# Altium project 恒温烤箱控制系统.PrjPCB
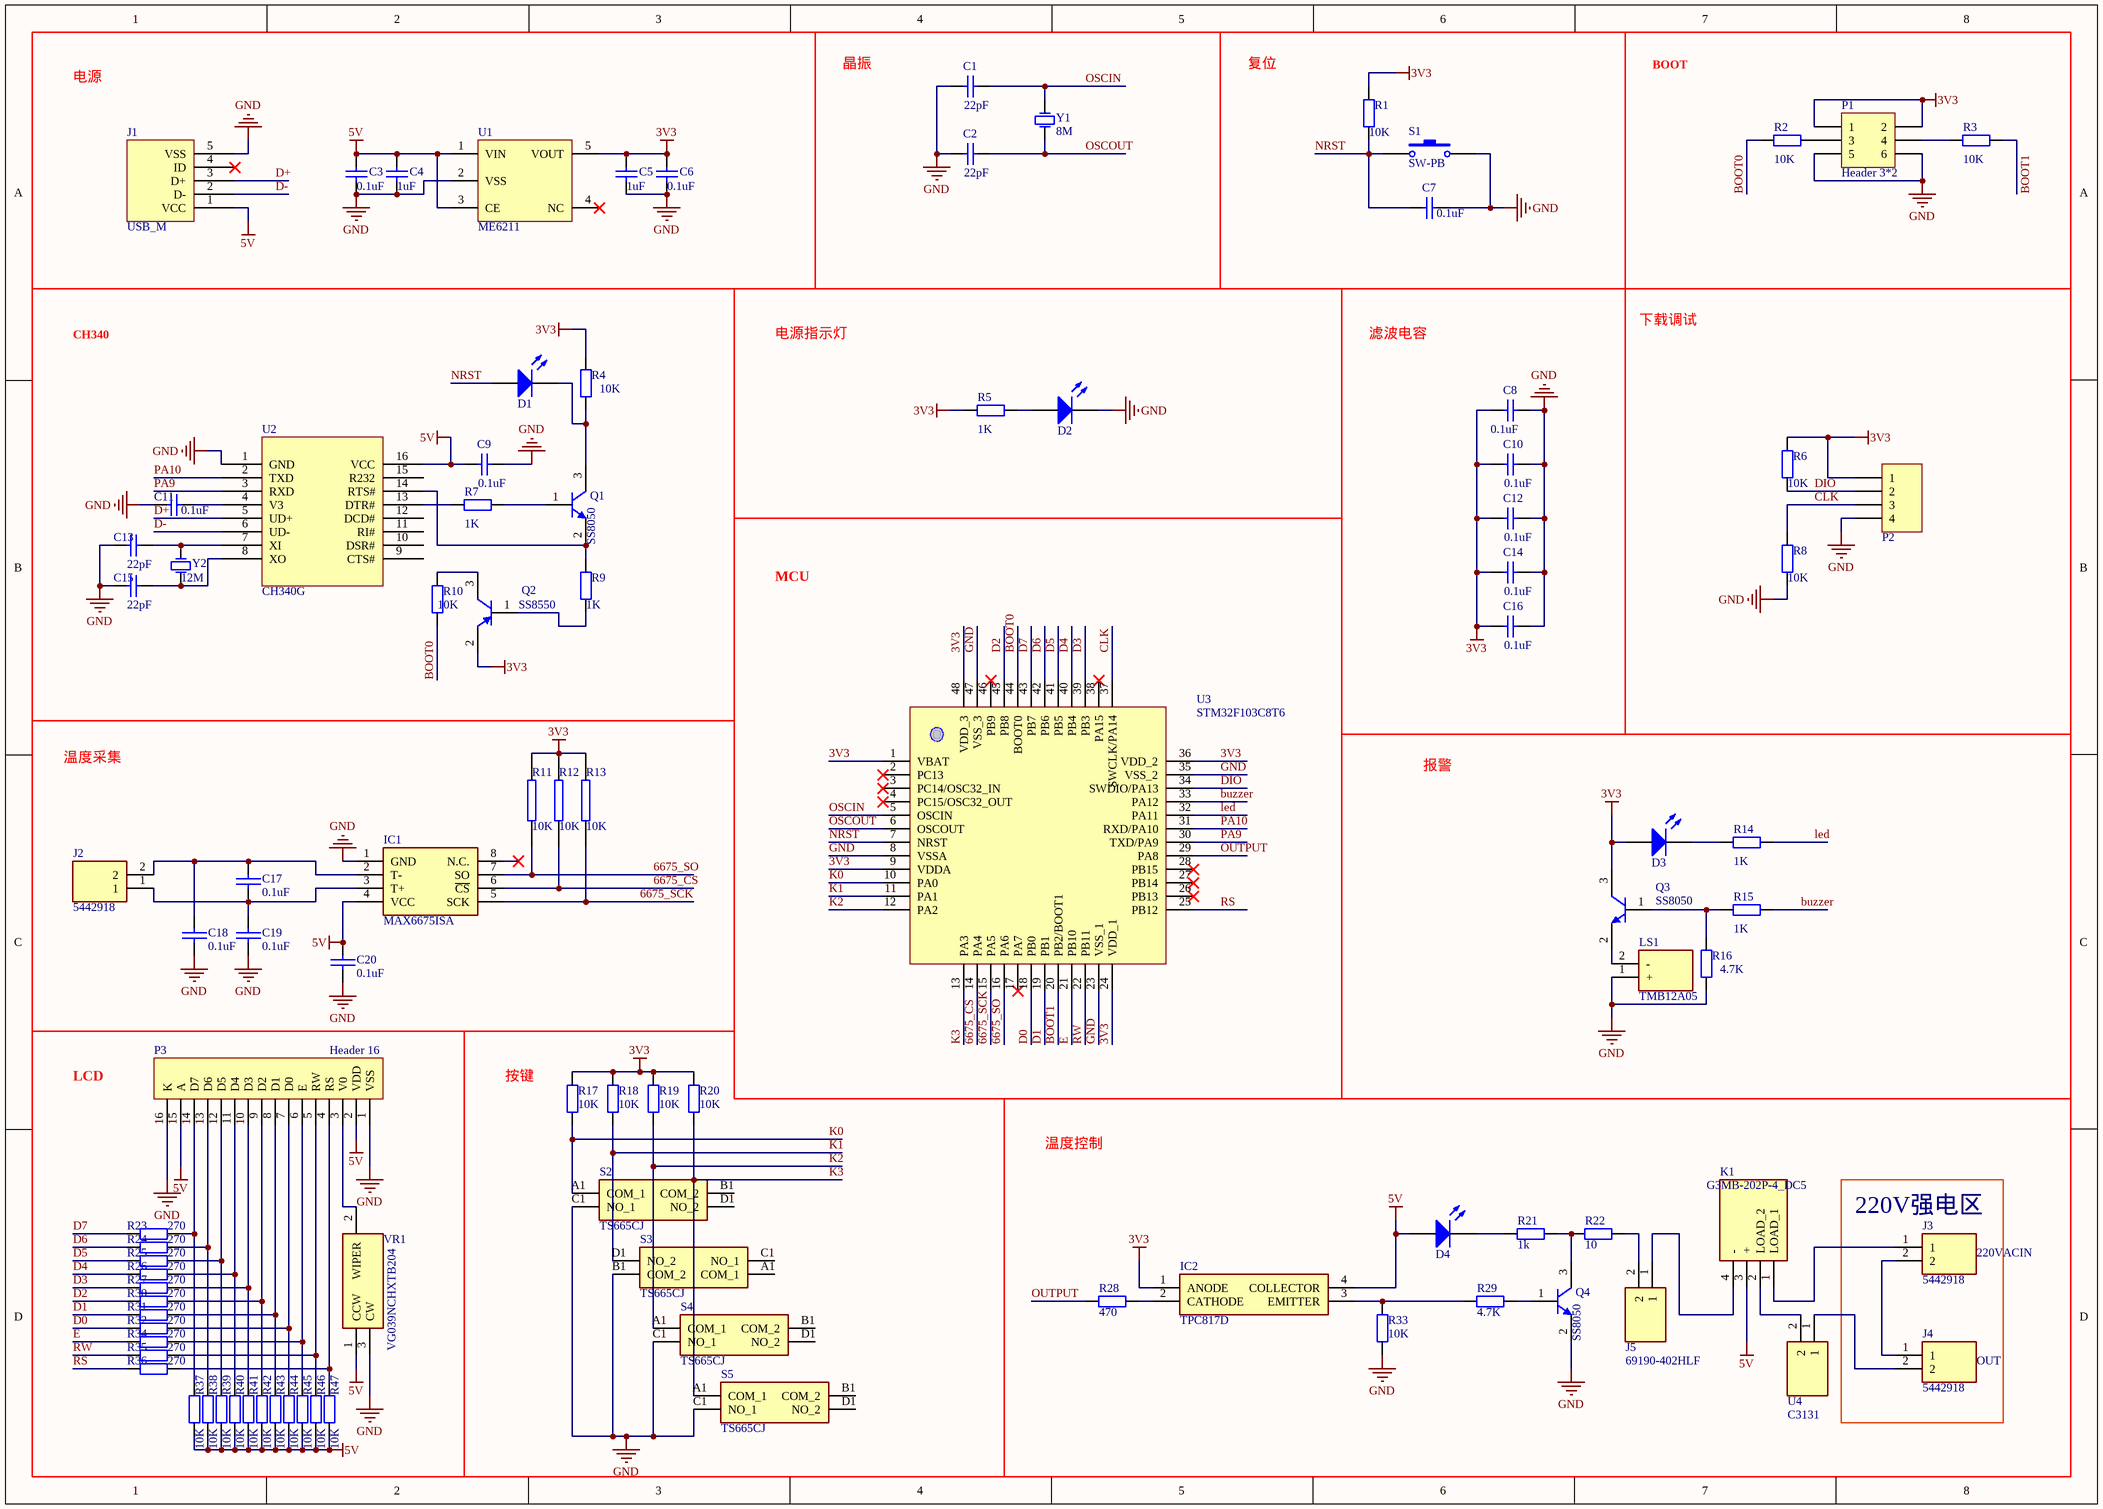
[diagram p0: sheet.SchDoc]
1 sheet, 99 parts. Net scope: global (net labels, ports and power ports of the same name join across sheets).
Board file: PCB.PcbDoc

## Sheet sheet.SchDoc
size A3

### Parts
C1  22pF  [0603_C]
C2  22pF  [0603_C]
C3  0.1uF  [0603_C]
C4  1uF  [0603_C]
C5  1uF  [0603_C]
C6  0.1uF  [0603_C]
C7  0.1uF  [0603_C]
C8  0.1uF  [0603_C]
C9  0.1uF  [0603_C]
C10  0.1uF  [0603_C]
C11  0.1uF  [0603_C]
C12  0.1uF  [0603_C]
C13  22pF  [0603_C]
C14  0.1uF  [0603_C]
C15  22pF  [0603_C]
C16  0.1uF  [0603_C]
C17  0.1uF  [1206]
C18  0.1uF  [1206]
C19  0.1uF  [1206]
C20  0.1uF  [1206]
D1  LED0  [LED_0805_Blue]  (value not drawn)
D2  LED0  [LED_0805_Blue]  (value not drawn)
D3  LED0  [LED_0805_Blue]  (value not drawn)
D4  LED0  [LED_0805_Blue]  (value not drawn)
IC1  MAX6675ISA  [SOIC127P600X175-8N]
IC2  TPC817D  [DIP810W50P254L460H368Q4N]
J1  USB_M  [USB]
J2  5442918  [SHDR2W100P0X508_1X2_1016X1120X1820P]
J3  5442918  [SHDR2W100P0X508_1X2_1016X1120X1820P]
J4  5442918  [SHDR2W100P0X508_1X2_1016X1120X1820P]
J5  69190-402HLF  [HDRV2W90P0X254_1X2_508X241X858P]
K1  G3MB-202P-4_DC5  [G3MB202P4DC5]
LS1  TMB12A05  [TMB12A05]
P1  Header 3*2  [HDR3X2]
P2  Header 4  [HDR4X1_A]  (value not drawn)
P3  Header 16  [HDR16X1_A]
Q1  SS8050  [SOT-23]
Q2  SS8550  [SOT-23]
Q3  SS8050  [SOT-23]
Q4  SS8050  [SOT-23]
R1  10K  [0603_R]
R2  10K  [0603_R]
R3  10K  [0603_R]
R4  10K  [0603_R]
R5  1K  [0603_R]
R6  10K  [0603_R]
R7  1K  [0603_R]
R8  10K  [0603_R]
R9  1K  [0603_R]
R10  10K  [0603_R]
R11  10K  [1206]
R12  10K  [1206]
R13  10K  [1206]
R14  1K  [0603_R]
R15  1K  [0603_R]
R16  4.7K  [0603_R]
R17  10K  [1206]
R18  10K  [1206]
R19  10K  [1206]
R20  10K  [1206]
R21  1k  [1206]
R22  10  [1206]
R23  270  [0603_R]
R24  270  [0603_R]
R25  270  [0603_R]
R26  270  [0603_R]
R27  270  [0603_R]
R28  470  [1206]
R29  4.7K  [1206]
R30  270  [0603_R]
R31  270  [0603_R]
R32  270  [0603_R]
R33  10K  [1206]
R34  270  [0603_R]
R35  270  [0603_R]
R36  270  [0603_R]
R37  10K  [0603_R]
R38  10K  [0603_R]
R39  10K  [0603_R]
R40  10K  [0603_R]
R41  10K  [0603_R]
R42  10K  [0603_R]
R43  10K  [0603_R]
R44  10K  [0603_R]
R45  10K  [0603_R]
R46  10K  [0603_R]
R47  10K  [0603_R]
S1  SW-PB  [SW_PB2_A1]
S2  TS665CJ  [TS665CJ]
S3  TS665CJ  [TS665CJ]
S4  TS665CJ  [TS665CJ]
S5  TS665CJ  [TS665CJ]
U1  ME6211  [SOT23-5]
U2  CH340G  [SOP-16]
U3  STM32F103C8T6  [LQFP-48_M]
U4  C3131  [C3131]
VR1  VG039NCHXTB204  [VG039NCHXTB204]
Y1  8M  [5032]
Y2  12M  [5032]

### Blocks framed on the sheet
220V强电区: J3 J4

### Nets
3V3: C5.2 C6.2 C8.2 C10.2 C12.2 C14.2 C16.2 D3.1(A) IC2.1(ANODE) P1.1 P1.2 P2.1 Q2.2(E) Q3.3(C) R1.2 R4.2 R5.1 R6.2 R11.2 R12.2 R13.2 R17.2 R18.2 R19.2 R20.2 U1.5(VOUT) U3.1(VBAT) U3.9(VDDA) U3.24(VDD_1) U3.36(VDD_2) U3.48(VDD_3)
5V: C3.2 C4.2 C9.1 C20.1 D4.1(A) IC1.4(VCC) IC2.4(COLLECTOR) J1.1(VCC) K1.3(+) P3.2(VDD) P3.15(A) R37.1 R38.1 R39.1 R40.1 R41.1 R42.1 R43.1 R44.1 R45.1 R46.1 R47.1 U1.1(VIN) U1.3(CE) U2.16(VCC) VR1.1(CCW)
GND: C1.2 C2.2 C3.1 C4.1 C5.1 C6.1 C7.2 C8.1 C9.2 C10.1 C11.1 C12.1 C13.2 C14.1 C15.2 C16.1 C18.2 C19.2 C20.2 D2.2(K) IC1.1(GND) J1.5(VSS) LS1.1(+) P1.5 P1.6 P2.4 P3.1(VSS) P3.16(K) Q4.2(E) R8.1 R16.1 R33.1 S1.2 S2.C1(NO_1) S3.B1(COM_2) S4.C1(NO_1) S5.C1(NO_1) U1.2(VSS) U2.1(GND) U3.8(VSSA) U3.23(VSS_1) U3.35(VSS_2) U3.47(VSS_3) VR1.3(CW)
6675_CS: IC1.6(~{CS}) R12.1 U3.14(PA4)
6675_SCK: IC1.5(SCK) R13.1 U3.15(PA5)
6675_SO: IC1.7(SO) R11.1 U3.16(PA6)
BOOT0: R2.1 R10.1 U3.44(BOOT0)
BOOT1: R3.2 U3.20(PB2/BOOT1)
buzzer: R15.2 U3.33(PA12)
CLK: P2.3 R8.2 U3.37(SWCLK/PA14)
D0: R32.2 U3.18(PB0)
D1: R31.2 U3.19(PB1)
D2: R30.2 U3.45(PB8)
D3: R27.2 U3.39(PB3)
D4: R26.2 U3.40(PB4)
D5: R25.2 U3.41(PB5)
D6: R24.2 U3.42(PB6)
D7: R23.2 U3.43(PB7)
D+: J1.3(D+) U2.5(UD+)
D-: J1.2(D-) U2.6(UD-)
DIO: P2.2 R6.1 U3.34(SWDIO/PA13)
E: R34.2 U3.21(PB10)
K0: R17.1 S2.A1(COM_1) U3.10(PA0)
K1: R18.1 S3.D1(NO_2) U3.11(PA1)
K2: R19.1 S4.A1(COM_1) U3.12(PA2)
K3: R20.1 S5.A1(COM_1) U3.13(PA3)
led: R14.2 U3.32(PA11)
NRST: C7.1 D1.1(A) R1.1 S1.1 U3.7(NRST)
OSCIN: C1.1 U3.5(OSCIN) Y1.1(OSC1)
OSCOUT: C2.1 U3.6(OSCOUT) Y1.2(OSC2)
OUTPUT: R28.2 U3.29(PA8)
PA9: U2.3(RXD) U3.30(TXD/PA9)
PA10: U2.2(TXD) U3.31(RXD/PA10)
RS: R36.2 U3.25(PB12)
RW: R35.2 U3.22(PB11)
NetC11_2: C11.2 U2.4(V3)
NetC13_1: C13.1 U2.7(XI) Y2.1(OSC1)
NetC15_1: C15.1 U2.8(XO) Y2.2(OSC2)
NetC17_1: C17.1 C18.1 IC1.2(T-) J2.2
NetC17_2: C17.2 C19.1 IC1.3(T+) J2.1
NetD1_2: D1.2(K) Q1.3(C) R4.1
NetD2_1: D2.1(A) R5.2
NetD3_2: D3.2(K) R14.1
NetD4_2: D4.2(K) R21.2
NetIC2_2: IC2.2(CATHODE) R28.1
NetIC2_3: IC2.3(EMITTER) R29.2 R33.2
NetJ3_1: J3.1 K1.1(LOAD_1)
NetJ3_2: J3.2 J4.1
NetJ4_2: J4.2 U4.1
NetJ5_1: J5.1 K1.4(-)
NetJ5_2: J5.2 R22.1
NetK1_2: K1.2(LOAD_2) U4.2
NetLS1_2: LS1.2(-) Q3.2(E)
NetP1_3: P1.3 R2.2
NetP1_4: P1.4 R3.1
NetP3_3: P3.3(V0) VR1.2(WIPER)
NetP3_4: P3.4(RS) R36.1 R47.2
NetP3_5: P3.5(RW) R35.1 R46.2
NetP3_6: P3.6(E) R34.1 R45.2
NetP3_7: P3.7(D0) R32.1 R44.2
NetP3_8: P3.8(D1) R31.1 R43.2
NetP3_9: P3.9(D2) R30.1 R42.2
NetP3_10: P3.10(D3) R27.1 R41.2
NetP3_11: P3.11(D4) R26.1 R40.2
NetP3_12: P3.12(D5) R25.1 R39.2
NetP3_13: P3.13(D6) R24.1 R38.2
NetP3_14: P3.14(D7) R23.1 R37.2
NetQ1_1: Q1.1(B) R7.2
NetQ1_2: Q1.2(E) R9.2 U2.14(RTS#)
NetQ2_1: Q2.1(B) R9.1
NetQ2_3: Q2.3(C) R10.2
NetQ3_1: Q3.1(B) R15.1 R16.2
NetQ4_1: Q4.1(B) R29.1
NetQ4_3: Q4.3(C) R21.1 R22.2
NetR7_1: R7.1 U2.13(DTR#)

Not connected (* = marked no-connect by the designer): IC1 8(N.C.)*; J1 4(ID)*; S2 B1(COM_2) D1(NO_2); S3 A1(COM_1) C1(NO_1); S4 B1(COM_2) D1(NO_2); S5 B1(COM_2) D1(NO_2); U1 4(NC)*; U2 9(CTS#) 10(DSR#) 11(RI#) 12(DCD#) 15(R232); U3 2(PC13)* 3(PC14/OSC32_IN)* 4(PC15/OSC32_OUT)* 17(PA7)* 26(PB13)* 27(PB14)* 28(PB15)* 38(PA15)* 46(PB9)*

### Notes on the sheet
- 电源
- 晶振
- 复位
- BOOT
- CH340
- 电源指示灯
- 滤波电容
- 下载调试
- MCU
- 温度采集
- 报警
- LCD
- (near R17) 按键
- 温度控制
- 220VACIN
- OUT

### Library data of the parts
C1-C16 = Cap: 无极性电容; Published: 8-Jun-2000; LatestRevisionDate: 17-Jul-2002; LatestRevisionNote: Re-released for DXP Platform.; PackageReference: RAD-0.3; Publisher: Altium Limited
  C1 C2 C13 C15: Value: 22pF
  C3 C6-C12 C14 C16: Value: 0.1uF
  C4 C5: Value: 1uF
C17-C20 = 普通电容: Capacitor
D1-D4 = LED0: 发光二极管; Published: 8-Jun-2000; LatestRevisionDate: 08-Jul-2005; LatestRevisionNote: Mech Layer 1 removed.; PackageReference: LED-0; Publisher: Altium Limited
IC1 = MAX6675ISA: Integrated Circuit; Manufacturer_Name: Maxim Integrated; Datasheet Link: http://datasheets.maximintegrated.com/en/ds/MAX6675.pdf; Height: 1.75mm; Manufacturer_Part_Number: MAX6675ISA; Mouser Part Number: N/A; Mouser Price/Stock: https://www.mouser.com/Search/Refine.aspx?Keyword=N%2FA
IC2 = TPC817D: Integrated Circuit; Manufacturer_Name: Taiwan Semiconductor; Datasheet Link: http://www.taiwansemi.com/products/datasheet/TPC817%20SERIES_C1612.pdf; Height: 3.68mm; Manufacturer_Part_Number: TPC817D; Mouser Part Number: 821-TPC817D; Mouser Price/Stock: https://www.mouser.com/Search/Refine.aspx?Keyword=821-TPC817D
J1 = USB_M: MicroUSB接口
J2-J4 = 5442918: Connector; Manufacturer_Name: Phoenix Contact; Allied_Number: 71272099; Datasheet Link: https://www.phoenixcontact.com/online/portal/gb/?uri=pxc-oc-itemdetail:pid=5442918&library=gben&pcck=P&tab=1&selectedCategory=ALL; Height: 18.2mm; Manufacturer_Part_Number: 5442918; Mouser Part Number: 651-5442918; Mouser Price/Stock: https://www.mouser.com/Search/Refine.aspx?Keyword=651-5442918; Allied Price/Stock: https://www.alliedelec.com/phoenixcontact-5442918/71272099/
J5 = 69190-402HLF: Connector; Manufacturer_Name: Amphenol; Allied_Number: 70302517; Datasheet Link: https://cdn.amphenol-icc.com/media/wysiwyg/files/drawing/69190.pdf; Height: 8.58mm; Manufacturer_Part_Number: 69190-402HLF; Mouser Part Number: 649-69190-402HLF; Mouser Price/Stock: https://www.mouser.com/Search/Refine.aspx?Keyword=649-69190-402HLF; RS Part Number: 8632731; RS Price/Stock: http://uk.rs-online.com/web/p/products/8632731; Allied Price/Stock: https://www.alliedelec.com/amphenol-fci-69190-402hlf/70302517/
K1 = G3MB-202P-4_DC5: Relay or Contactor; Manufacturer_Name: Omron Electronics; Manufacturer_Part_Number: G3MB-202P-4 DC5; Datasheet Link: https://componentsearchengine.com/Datasheets/1/G3MB-202P-4 DC5.pdf; Height: 20.5mm; Mouser Part Number: 653-G3MB-202P4DC5; Mouser Price/Stock: http://www.mouser.com/Search/ProductDetail.aspx?qs=Z0CfnKMjtWg7MIsv3RC0Aw%3d%3d
LS1 = TMB12A05: Loudspeaker or Buzzer; Manufacturer_Name: Jiangsu Huaneng Elec; Datasheet Link: https://datasheet.lcsc.com/szlcsc/Jiangsu-Huaneng-Elec-TMB12A05_C96093.pdf; Height: 9.5mm; Manufacturer_Part_Number: TMB12A05
P1 = Header 3*2: 接插件
P2 = Header 4: 接插件; LatestRevisionDate: 17-Jul-2002; LatestRevisionNote: Re-released for DXP Platform.; Publisher: Altium Limited
P3 = Header 16: Header16贴片; LatestRevisionDate: 17-Jul-2002; LatestRevisionNote: Re-released for DXP Platform.; Publisher: Altium Limited
Q1 Q3 Q4 = SS8050: NPN贴片三极管; Published: 8-Jun-2000; LatestRevisionDate: 15-Jan-2003; LatestRevisionNote: PCB Footprint 'BCY-W3/D4.7' replaced; DatasheetDocument: 1997; PackageDocument: Sep-1998; PackageReference: TO-92A; Publisher: Altium Limited; Code_JEDEC: TO-92A; ComponentLink1Description: Manufacturer Link; ComponentLink1URL: http://www.fairchildsemi.com/; ComponentLink2Description: Datasheet; ComponentLink2URL: http://www.fairchildsemi.com/ds/2N%2F2N3904.pdf
Q2 = SS8550: PNP贴片三极管; Published: 8-Jun-2000; LatestRevisionDate: 15-Jan-2003; LatestRevisionNote: PCB Footprint 'BCY-W3/D4.7' replaced; DatasheetDocument: 1997; PackageDocument: Sep-1998; PackageReference: TO-92A; Publisher: Altium Limited; Code_JEDEC: TO-92A; ComponentLink1Description: Manufacturer Link; ComponentLink1URL: http://www.fairchildsemi.com/; ComponentLink2Description: Datasheet; ComponentLink2URL: http://www.fairchildsemi.com/ds/2N%2F2N3906.pdf
R1-R10 R14-R16 R23-R27 R30-R32 R34-R47 = Res1: 贴片电阻; Published: 8-Jun-2000; LatestRevisionDate: 17-Jul-2002; LatestRevisionNote: Re-released for DXP Platform.; PackageReference: AXIAL-0.4; Publisher: Altium Limited
  R1-R4 R6 R8 R10 R37-R47: Value: 10K
  R5 R7 R9 R14 R15: Value: 1K
  R16: Value: 4.7K
  R23-R27 R30-R32 R34-R36: Value: 270
R11-R13 = RES2
R17-R20 R33 = Res2: Resistor; Published: 8-Jun-2000; LatestRevisionDate: 17-Jul-2002; LatestRevisionNote: Re-released for DXP Platform.; PackageReference: AXIAL-0.4; Publisher: Altium Limited; PackageDescription: Axial Device, Thru-Hole; 2 Leads; 0.4 in Pin Spacing; Value: 10K
R21 R22 R28 R29 = Res2: Resistor; Value: 10K; Published: 8-Jun-2000; LatestRevisionDate: 17-Jul-2002; LatestRevisionNote: Re-released for DXP Platform.; PackageReference: AXIAL-0.4; Publisher: Altium Limited; PackageDescription: Axial Device, Thru-Hole; 2 Leads; 0.4 in Pin Spacing
S1 = SW-PB: 微动开关; Published: 24-Mar-1999; LatestRevisionDate: 17-Jul-2002; LatestRevisionNote: Re-released for DXP Platform.; PackageReference: SPST-2; Publisher: Altium Limited
S2-S5 = TS665CJ: Switch; Manufacturer_Name: Shou Han; Datasheet Link: https://datasheet.lcsc.com/szlcsc/1910111742_SHOU-HAN-TS665CJ_C393938.pdf; Height: 5.15mm; Manufacturer_Part_Number: TS665CJ
U2 = CH340G: 串口芯片
U3 = STM32F103C8T6: STM32单片机48引脚
U4 = C3131: Undefined or Miscellaneous; Manufacturer_Name: Xucheng Elec; Datasheet Link: https://datasheet.lcsc.com/szlcsc/XC-Elec-Shenzhen-5x20-BLX-Fuse-holder_C3131.pdf; Height: 10.5mm; Manufacturer_Part_Number: C3131
VR1 = VG039NCHXTB204: Variable Resistor; Manufacturer_Name: Hokuriku Elec Industry; Datasheet Link: https://datasheet.lcsc.com/szlcsc/Hokuriku-Elec-Industry-VG039NCHXTB204_C128551.pdf; Height: 1.2mm; Manufacturer_Part_Number: VG039NCHXTB204
Y1 Y2 = XTAL: 晶振; Published: 8-Jun-2000; LatestRevisionDate: 17-Jul-2002; LatestRevisionNote: Re-released for DXP Platform.; PackageReference: R38; Publisher: Altium Limited